# Altium schematic sheet YakupTrkn1.SchDoc
size A4
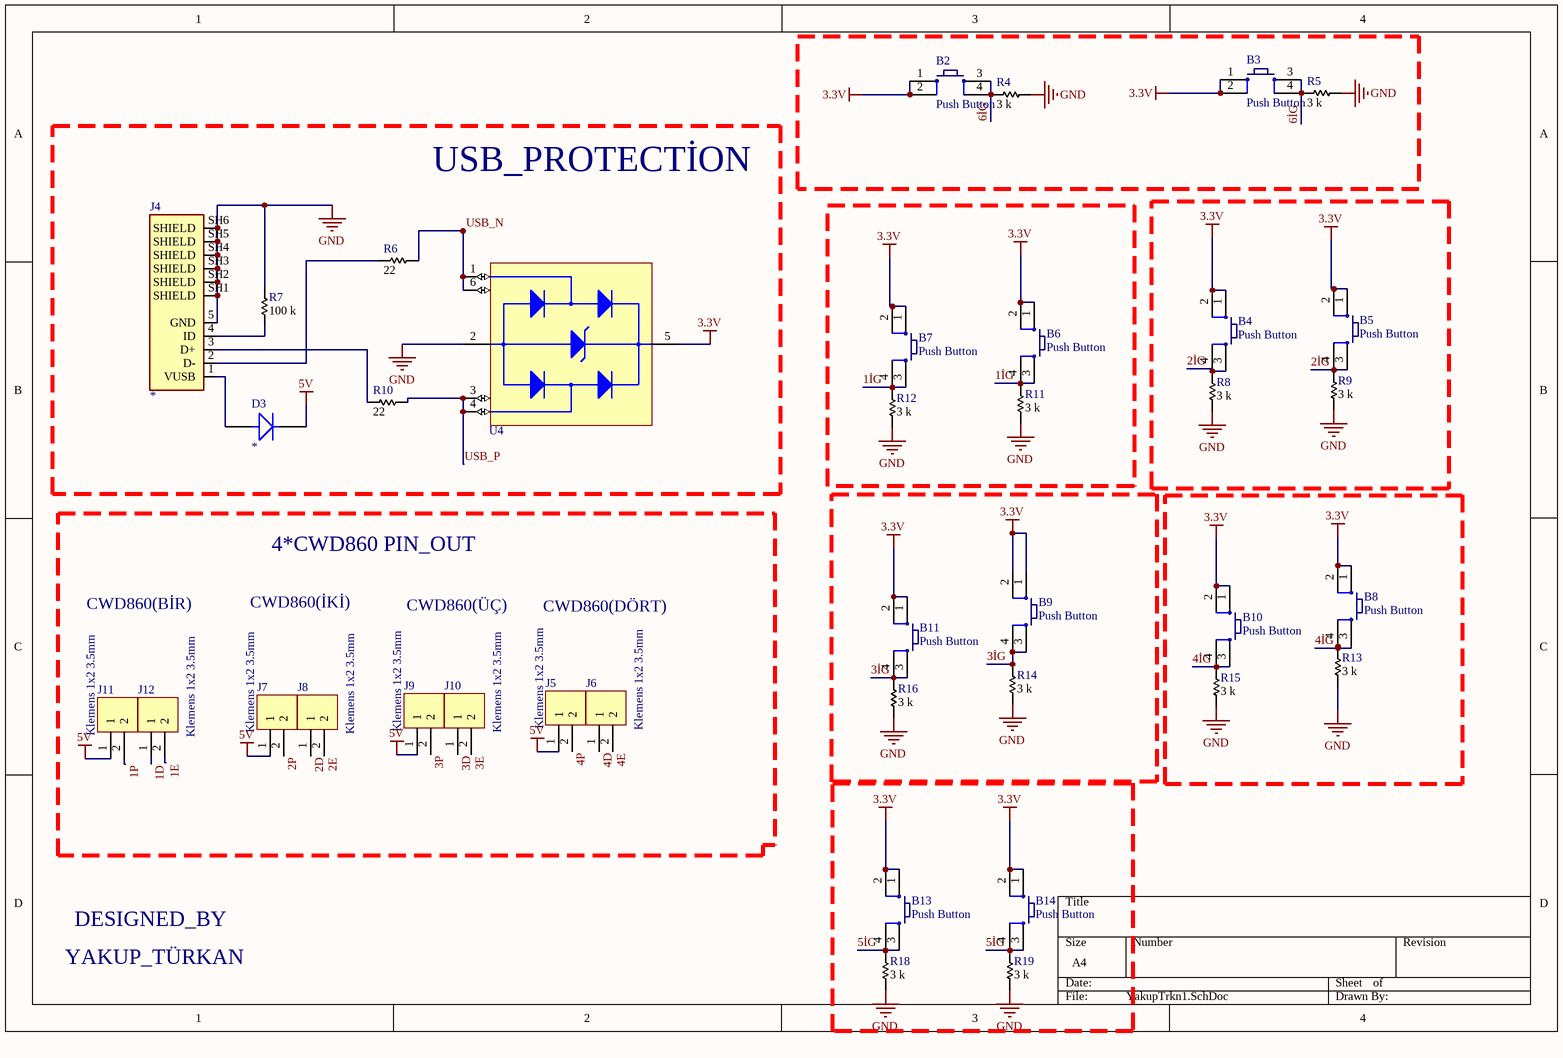
[diagram p0: YakupTrkn1.SchDoc]

## Parts
B2  Push Button  [PUSB BUTTON-SMD]
B3  Push Button  [PUSB BUTTON-SMD]
B4  Push Button  [PUSB BUTTON-SMD]
B5  Push Button  [PUSB BUTTON-SMD]
B6  Push Button  [PUSB BUTTON-SMD]
B7  Push Button  [PUSB BUTTON-SMD]
B8  Push Button  [PUSB BUTTON-SMD]
B9  Push Button  [PUSB BUTTON-SMD]
B10  Push Button  [PUSB BUTTON-SMD]
B11  Push Button  [PUSB BUTTON-SMD]
B13  Push Button  [PUSB BUTTON-SMD]
B14  Push Button  [PUSB BUTTON-SMD]
D3  *  [DIOM5226X220N]
J4  *  [AMPHENOL_10118192-0001LF]
J5  Klemens 1x2 3.5mm  [Klemens 1x2 - 3.5mm]
J6  Klemens 1x2 3.5mm  [Klemens 1x2 - 3.5mm]
J7  Klemens 1x2 3.5mm  [Klemens 1x2 - 3.5mm]
J8  Klemens 1x2 3.5mm  [Klemens 1x2 - 3.5mm]
J9  Klemens 1x2 3.5mm  [Klemens 1x2 - 3.5mm]
J10  Klemens 1x2 3.5mm  [Klemens 1x2 - 3.5mm]
J11  Klemens 1x2 3.5mm  [Klemens 1x2 - 3.5mm]
J12  Klemens 1x2 3.5mm  [Klemens 1x2 - 3.5mm]
R4  Resistance: 3 k  [ROYALOHM_RES_0805]  (hidden comment: 0805S8F3001T5E)
R5  Resistance: 3 k  [ROYALOHM_RES_0805]  (hidden comment: 0805S8F3001T5E)
R6  Resistance: 22  [ROYALOHM_RES_0805]  (hidden comment: 0805W8J0220T5E)
R7  Resistance: 100 k  [ROYALOHM_RES_0603]  (hidden comment: 0603SAJ0104T5E)
R8  Resistance: 3 k  [ROYALOHM_RES_0805]  (hidden comment: 0805S8F3001T5E)
R9  Resistance: 3 k  [ROYALOHM_RES_0805]  (hidden comment: 0805S8F3001T5E)
R10  Resistance: 22  [ROYALOHM_RES_0805]  (hidden comment: 0805W8J0220T5E)
R11  Resistance: 3 k  [ROYALOHM_RES_0805]  (hidden comment: 0805S8F3001T5E)
R12  Resistance: 3 k  [ROYALOHM_RES_0805]  (hidden comment: 0805S8F3001T5E)
R13  Resistance: 3 k  [ROYALOHM_RES_0805]  (hidden comment: 0805S8F3001T5E)
R14  Resistance: 3 k  [ROYALOHM_RES_0805]  (hidden comment: 0805S8F3001T5E)
R15  Resistance: 3 k  [ROYALOHM_RES_0805]  (hidden comment: 0805S8F3001T5E)
R16  Resistance: 3 k  [ROYALOHM_RES_0805]  (hidden comment: 0805S8F3001T5E)
R18  Resistance: 3 k  [ROYALOHM_RES_0805]  (hidden comment: 0805S8F3001T5E)
R19  Resistance: 3 k  [ROYALOHM_RES_0805]  (hidden comment: 0805S8F3001T5E)
U4  USBLC6-2SC6  [SOT23-6L]  (value not drawn)

## Nets
3.3V: B2.1 B2.2 B3.1 B3.2 B4.1 B4.2 B5.1 B5.2 B6.1 B6.2 B7.1 B7.2 B8.1 B8.2 B9.1 B9.2 B10.1 B10.2 B11.1 B11.2 B13.1 B13.2 B14.1 B14.2 U4.5(VBUS)
5V: D3.1(K) J5.1 J7.1 J9.1 J11.1
GND: J4.5(GND) J4.SH1(SHIELD) J4.SH2(SHIELD) J4.SH3(SHIELD) J4.SH4(SHIELD) J4.SH5(SHIELD) J4.SH6(SHIELD) R4.1 R5.1 R7.2 R8.1 R9.1 R11.1 R12.1 R13.1 R14.1 R15.1 R16.1 R18.1 R19.1 U4.2(GND)
1D: J12.1
1E: J12.2
1İG: B6.3 B6.4 B7.3 B7.4 R11.2 R12.2
1P: J11.2
2D: J8.1
2E: J8.2
2İG: B4.3 B4.4 B5.3 B5.4 R8.2 R9.2
2P: J7.2
3D: J10.1
3E: J10.2
3İG: B9.3 B9.4 B11.3 B11.4 R14.2 R16.2
3P: J9.2
4D: J6.1
4E: J6.2
4İG: B8.3 B8.4 B10.3 B10.4 R13.2 R15.2
4P: J5.2
5İG: B13.3 B13.4 B14.3 B14.4 R18.2 R19.2
6İG: B2.3 B2.4 B3.3 B3.4 R4.2 R5.2
USB_N: R6.2 U4.1(I/O1) U4.6(I/O1)
USB_P: R10.2 U4.3(I/O2) U4.4(I/O2)
NetD3_2: D3.2(A) J4.1(VUSB)
NetJ4_2: J4.2(D-) R6.1
NetJ4_3: J4.3(D+) R10.1
NetJ4_4: J4.4(ID) R7.1

## Notes on the sheet
- USB_PROTECTİON
- 4*CWD860 PIN_OUT
- CWD860(BİR)
- CWD860(İKİ)
- CWD860(ÜÇ)
- CWD860(DÖRT)
- YAKUP_TÜRKAN
- DESIGNED_BY

## Library data of the parts
B2-B11 B13 B14 = Push Button: Smd Push Button; Satın Alma Linki: https://urun.n11.com/diger/mini-pushbutton-switch-smd-P227461537?gclid=Cj0KCQjwkoDmBRCcARIsAG3xzl8Y_-jeD7HocNM6lvuZ_rVp83568XPGtNzlPwXWLph8oCRqo0yh87UaApZYEALw_wcB&gclsrc=aw.ds
D3 = MBRA210LT3G: ...employing the Schottky Barrier principle in a metal to silicon power rectifier.; MF: {'manufacturer': u'ON Semiconductor'}; Price: None; Availability: Unavailable; MP: MBRA210LT3G; Value: *; Package: None
J4 = 10118192-0001LF: Single Port 5 Contact Horizontal Right Angle Shielded Micro B USB 2.0 Connector; MF: {'manufacturer': u'FCI'}; Package: None; Availability: Unavailable; Value: *; MP: 10118192-0001LF; Price: None
R4 R5 R8 R9 R11-R16 R18 R19 = 0805S8F3001T5E: RES SMD 3K OHM 1% 1/8W 0805
R6 R10 = 0805W8J0220T5E: RES SMD 22 OHM 5% 1/8W 0805
R7 = 0603SAJ0104T5E: RES SMD 100K OHM 5% 1/10W 0603
U4 = USB PROTECTION: TVS DIODE 5.25V 17V SOT23-6; Manufacturer: STMicroelectronics; Designed by: BERK; Direction: Unidirectional,Bidirectional; Capacitance: 3.5pF; Operating Supply Voltage: 1.1V; Number of Channels: 2; Breakdown Voltage: 6V; Power Line Protection: Yes; Test Current: 1mA; Max Reverse Leakage Current: 150nA; Peak Pulse Current: 5A; Element Configuration: Dual; Data Rate: 480Mbps; Number of Elements: 1; Working Voltage: 5V; Supplier 1: Digi-Key; Manufacturer Part Number: USBLC6-2SC6; RoHS: Yes; Category: TVS Diodes; Stock 1: 112981; Pricing 1: 1=0,50000, 10=0,43100, 100=0,29930, 500=0,23368, 1000=0,19005 (USD); Mount: Surface Mount; Case/Package: SOT-23; Number of Pins: 6; Contact Plating: Tin,Matte; Min Operating Temperature: -40°C; Max Operating Temperature: 125°C; Clamping Voltage: 17V; Packaging: Tape and Reel; Package Quantity: 3000; Termination: SMD/SMT; Number of Bidirectional Channels: 2; Reverse Standoff Voltage: 5.25V; Min Breakdown Voltage: 6V; ESD Protection: Yes; Leakage Current: 150nA; Series: USB; Reverse Breakdown Voltage: 6V; Polarity: Unidirectional,Bidirectional; Max Breakdown Voltage: 6V; Clamping Voltage-Max: 17V; Length: 3.05mm; Width: 1.75mm; Height: 1.3mm; Depth: 1.75mm; Radiation Hardening: No; REACH SVHC: No SVHC; Lead Free: Lead Free; RoHS Compliant: Yes; ComponentLink1URL: https://datasheet.ciiva.com/1268/1690354-1268384.pdf?src-supplier=Element14; ComponentLink1Description: https://datasheet.ciiva.com/1268/1690354-1268384.pdf?src-supplier=Element14; ComponentLink2URL: https://datasheet.ciiva.com/4508/cd00050750-113117-4508433.pdf?src-supplier=Mouser; ComponentLink2Description: https://datasheet.ciiva.com/4508/cd00050750-113117-4508433.pdf?src-supplier=Mouser; ComponentLink3URL: https://datasheet.ciiva.com/15143/getdatasheetpartid-148465-15143789.pdf?src-supplier=Verical; ComponentLink3Description: https://datasheet.ciiva.com/15143/getdatasheetpartid-148465-15143789.pdf?src-supplier=Verical; ComponentLink4URL: https://datasheet.ciiva.com/26787/usblc6-2sc6-26787908.pdf?src-supplier=IIIC; ComponentLink4Description: https://datasheet.ciiva.com/26787/usblc6-2sc6-26787908.pdf?src-supplier=IIIC; ComponentLink5URL: https://datasheet.ciiva.com/16200/cd00050750-16200026.pdf?src-supplier=Future+Electronics; ComponentLink5Description: https://datasheet.ciiva.com/16200/cd00050750-16200026.pdf?src-supplier=Future+Electronics; ComponentLink6URL: https://datasheet.ciiva.com/41444/001184109-da-01-en-ic-esd-protecti-usblc6-2sc6-sot-23-6-stm-41444156.pdf?src-supplier=Conrad; ComponentLink6Description: https://datasheet.ciiva.com/41444/001184109-da-01-en-ic-esd-protecti-usblc6-2sc6-sot-23-6-stm-41444156.pdf?src-supplier=Conrad; Supplier Part Number 1: 497-5235-1-ND